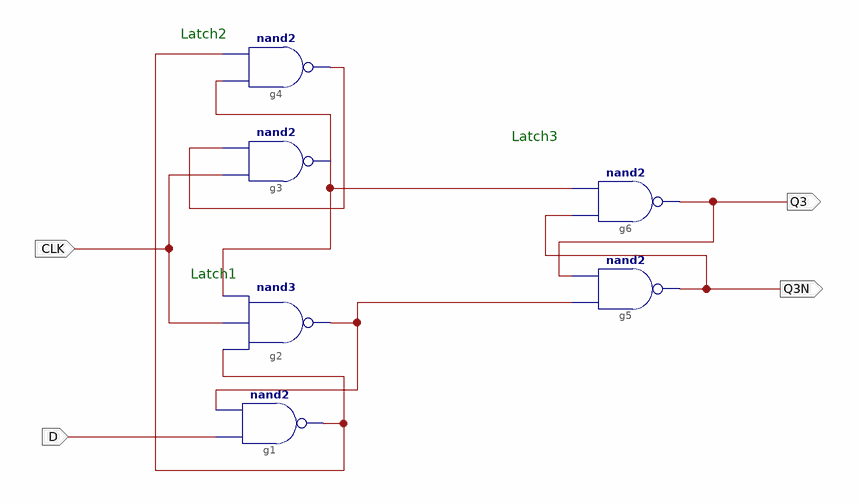
[diagram p0: schematic sheet 1]
// Xilinx ISE schematic FFDMazzeoFronteSalita.sch (spartan3e) as structural Verilog: 6 symbols, 4 ports
module FFDMazzeoFronteSalita (
  input  CLK,
  input  D,
  output Q3,
  output Q3N
);

  wire Q1, Q1N, Q2, Q2N;

  nand g4 (Q2, Q2N, Q1N);
  nand g6 (Q3, Q3N, Q2N);
  nand g5 (Q3N, Q1, Q3);
  nand g2 (Q1, Q1N, CLK, Q2N);
  nand g1 (Q1N, D, Q1);
  nand g3 (Q2N, CLK, Q2);

  // Notes on the sheet:
  //   Latch2
  //   Latch3
  //   Latch1
endmodule
